# Altium schematic sheet IMX_Power Regulation.SchDoc
size A4; SheetNumber: 2; SheetTotal: 8
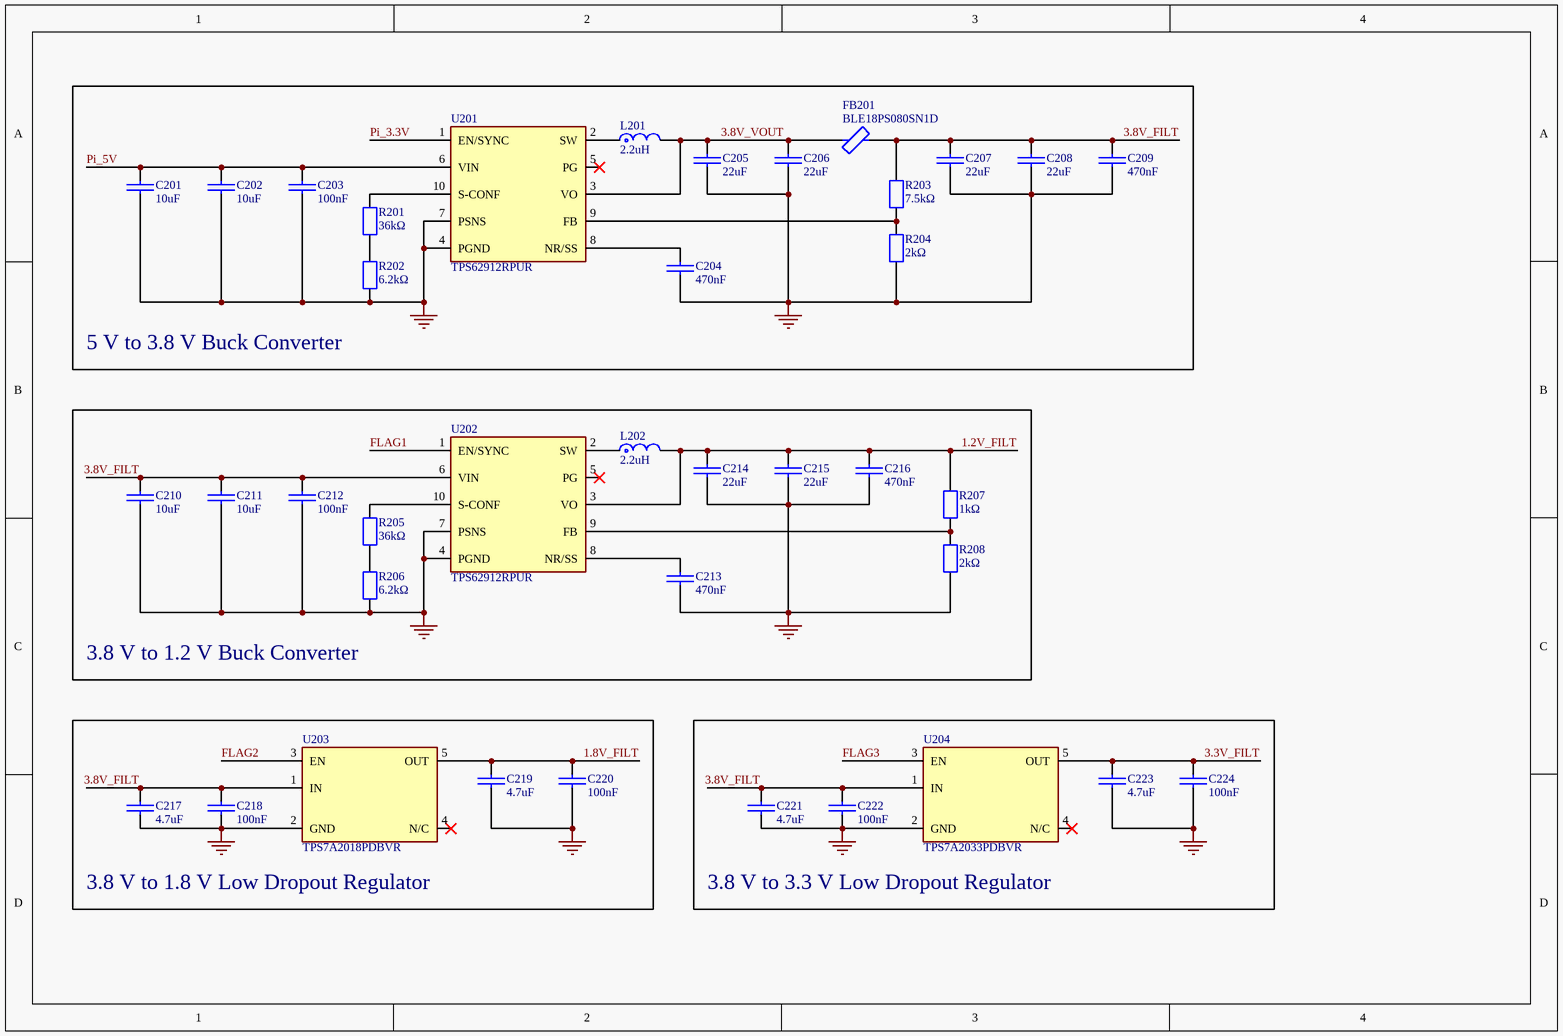
[diagram p0: IMX_Power Regulation.SchDoc]

## Parts
C201  10uF  [Capacitor, 0603]
C202  10uF  [Capacitor, 0603]
C203  100nF  [Capacitor, 0402]
C204  470nF  [Capacitor, 0402]
C205  22uF  [Capacitor, 0805]
C206  22uF  [Capacitor, 0805]
C207  22uF  [Capacitor, 0805]
C208  22uF  [Capacitor, 0805]
C209  470nF  [Capacitor, 0402]
C210  10uF  [Capacitor, 0603]
C211  10uF  [Capacitor, 0603]
C212  100nF  [Capacitor, 0402]
C213  470nF  [Capacitor, 0402]
C214  22uF  [Capacitor, 0805]
C215  22uF  [Capacitor, 0805]
C216  470nF  [Capacitor, 0402]
C217  4.7uF  [Capacitor, 0603]
C218  100nF  [Capacitor, 0402]
C219  4.7uF  [Capacitor, 0603]
C220  100nF  [Capacitor, 0402]
C221  4.7uF  [Capacitor, 0603]
C222  100nF  [Capacitor, 0402]
C223  4.7uF  [Capacitor, 0603]
C224  100nF  [Capacitor, 0402]
FB201  BLE18PS080SN1D  [Ferrite Bead, 0603]
L201  2.2uH  [Inductor, 1616]
L202  2.2uH  [Inductor, 1616]
R201  36kΩ  [Resistor, 0603, Yageo]
R202  6.2kΩ  [Resistor, 0603, Yageo]
R203  7.5kΩ  [Resistor, 0603, Yageo]
R204  2kΩ  [Resistor, 0603, Yageo]
R205  36kΩ  [Resistor, 0603, Yageo]
R206  6.2kΩ  [Resistor, 0603, Yageo]
R207  1kΩ  [Resistor, 0603, Yageo]
R208  2kΩ  [Resistor, 0603, Yageo]
U201  TPS62912RPUR  [Buck Converter, TPS62912RPUR]
U202  TPS62912RPUR  [Buck Converter, TPS62912RPUR]
U203  TPS7A2018PDBVR  [TPS7A20 - SOT-23-5L]
U204  TPS7A2033PDBVR  [TPS7A20 - SOT-23-5L]

## Blocks framed on the sheet
5 V to 3.8 V Buck Converter: C201-C209 FB201 L201 R201-R204 U201
3.8 V to 1.2 V Buck Converter: C210-C216 L202 R205-R208 U202
3.8 V to 1.8 V Low Dropout Regulator: C217-C220 U203
3.8 V to 3.3 V Low Dropout Regulator: C221-C224 U204

## Nets
GND: C201.2 C202.2 C203.2 C204.2 C205.2 C206.2 C207.2 C208.2 C209.2 C210.2 C211.2 C212.2 C213.2 C214.2 C215.2 C216.2 C217.2 C218.2 C219.2 C220.2 C221.2 C222.2 C223.2 C224.2 R202.1 R204.1 R206.1 R208.1 U201.4(PGND) U201.7(PSNS) U202.4(PGND) U202.7(PSNS) U203.2(GND) U204.2(GND)
1.2V_FILT: C214.1 C215.1 C216.1 L202.2 R207.2 U202.3(VO)
1.8V_FILT: C219.1 C220.1 U203.5(OUT)
3.3V_FILT: C223.1 C224.1 U204.5(OUT)
3.8V_FILT: C207.1 C208.1 C209.1 C210.1 C211.1 C212.1 C217.1 C218.1 C221.1 C222.1 FB201.2 R203.2 U202.6(VIN) U203.1(IN) U204.1(IN)
3.8V_VOUT: C205.1 C206.1 FB201.1 L201.2 U201.3(VO)
FLAG1: U202.1(EN/SYNC)
FLAG2: U203.3(EN)
FLAG3: U204.3(EN)
Pi_3.3V: U201.1(EN/SYNC)
Pi_5V: C201.1 C202.1 C203.1 U201.6(VIN)
NetC204_1: C204.1 U201.8(NR/SS)
NetC213_1: C213.1 U202.8(NR/SS)
NetL201_1: L201.1 U201.2(SW)
NetL202_1: L202.1 U202.2(SW)
NetR201_1: R201.1 R202.2
NetR201_2: R201.2 U201.10(S-CONF)
NetR203_1: R203.1 R204.2 U201.9(FB)
NetR205_1: R205.1 R206.2
NetR205_2: R205.2 U202.10(S-CONF)
NetR207_1: R207.1 R208.2 U202.9(FB)

Not connected (* = marked no-connect by the designer): U201 5(PG)*; U202 5(PG)*; U203 4(N/C)*; U204 4(N/C)*

## Library data of the parts
C201 C202 C210 C211 = Capacitor, 0603, 10uF: Ceramic Capacitor, 10V, 10% +/- Tol, X7R, 10uF, SMD, 0603, #GRM188Z71A106KA73D, JLC#C2959727; Capacitance: 10uF
C203 C212 C218 C220 C222 C224 = Capacitor, 0402, 100nF: Ceramic Capacitor, 16V, 10% +/- Tol, X7R, 0.1uF, SMD, 0402, #CL05B104KO5NNNC, JLC#C1525; Capacitance: 100nF
C204 C209 C213 C216 = Capacitor, 0402, 470nF: 16V 470nF X7R ±10% 0402 Multilayer Ceramic Capacitors MLCC - SMD/SMT ROHS, #GRM155R71C474KE01D, JLC#C471404; Capacitance: 470nF
C205-C208 C214 C215 = Capacitor, 0805, 22uF, X5R: 16V 22uF X5R ±10% 0805 Multilayer Ceramic Capacitors MLCC - SMD/SMT ROHS, #CL21A226KOQNNNE, JLC#C296720; Capacitance: 22uF
C217 C219 C221 C223 = Capacitor, 0603, 4.7uF: Ceramic Capacitor, 10V, 10% +/- Tol, X7R, 4.7uF, SMD, 0603, #GRM188Z71A475KE15D, JLC#C913474; Capacitance: 4.7uF
FB201 = Ferrite Bead, 0603, 4mΩ 8.5Ω@100MHz: 4mΩ 8.5Ω@100MHz 0603 Ferrite Beads ROHS, #BLE18PS080SN1D, JLC#C3764407
L201 L202 = Inductor, 1616, 2.2uH: 2.2uH ±20% 7A 1616 Power Inductors ROHS, #XGL4030-222MEC, JLC#C6616463; Core Material: Composite; Test Frequency: 100kHz; Shielding: Shielded; Self Resonant Frequency: 89MHz; Saturation Current: 3.5A; Max DC Current: 11.2A; DC Resistance (DCR): 8.36mR; RMS Current (Irms): 7A; Case/Package: SMD/SMT; Inductance: 2.2uH; Min Operating Temperature: -40°C; Tolerance: 20%; Inductance Tolerance: 20%; Height: 1.6mm; REACH SVHC: No SVHC; Series: XFL4015; Lead Free: Contains Lead; Termination: SMD/SMT; Mount: Surface Mount; Package Quantity: 40; Width: 4.3mm; Packaging: Tape and Reel; Max Operating Temperature: 125°C; Length: 4.3mm; RoHS Compliant: Yes
R201 R205 = Resistor, 0603, 36kΩ: 100mW Thick Film Resistors 75V ±100ppm/℃ ±1% 36kΩ 0603 Chip Resistor - Surface Mount ROHS, #RC0603FR-0736KL, JLC#C114619
R202 R206 = Resistor, 0603, 6.2kΩ: 100mW Thick Film Resistors 75V ±100ppm/℃ ±1% 6.2kΩ 0603 Chip Resistor - Surface Mount ROHS, #RC0603FR-076K2L, JLC#C114631
R203 = Resistor, 0603, 7.5kΩ: 100mW Thick Film Resistors 75V ±100ppm/℃ ±1% 7.5kΩ 0603 Chip Resistor - Surface Mount ROHS, #RC0603FR-077K5L, JLC#C114634
R204 R208 = Resistor, 0603, 2kΩ: 100mW Thick Film Resistors 75V ±100ppm/℃ ±1% 2kΩ 0603 Chip Resistor - Surface Mount ROHS, #RC0603FR-072KL, JLC#C105576
R207 = Resistor, 0603, 1kΩ: Thick Film Resistor, ±1%, ±100ppm/℃, -55℃~+155℃, 0603 Chip Resistor - Surface Mount ROHS, #RC0603FR-071KL, JLC#C22548
U201 U202 = Buck Converter, TPS62912RPUR: Step-down type Adjustable 2A 800mV~5.5V 3V~17V VQFN-10-HR(2x2) DC-DC Converters ROHS, JLC#C3198056; Manufacturer_Name: Texas Instruments; Datasheet Link: https://www.ti.com/lit/gpn/TPS62912; Height: 1mm; Manufacturer_Part_Number: TPS62912RPUR; Mouser Part Number: 595-TPS62912RPUR; Mouser Price/Stock: https://www.mouser.co.uk/ProductDetail/Texas-Instruments/TPS62912RPUR?qs=DRkmTr78QAT3V6egI4ak1w%3D%3D; Arrow Part Number: TPS62912RPUR; Arrow Price/Stock: https://www.arrow.com/en/products/tps62912rpur/texas-instruments?utm_currency=USD&region=europe
U203 = TPS7A2018PDBVR, 1.8V: 300mA Fixed 1.8V Positive electrode 6V SOT-23-5L Voltage Regulators - Linear, Low Drop Out (LDO) Regulators ROHS, JLC#C963430
U204 = TPS7A2018PDBVR, 3.3V: 300mA Fixed 3.3V Positive electrode 6V SOT-23-5 Voltage Regulators - Linear, Low Drop Out (LDO) Regulators ROHS, JLC#C2862740